# EAGLE schematic schematic (EAGLE 9.6.2)
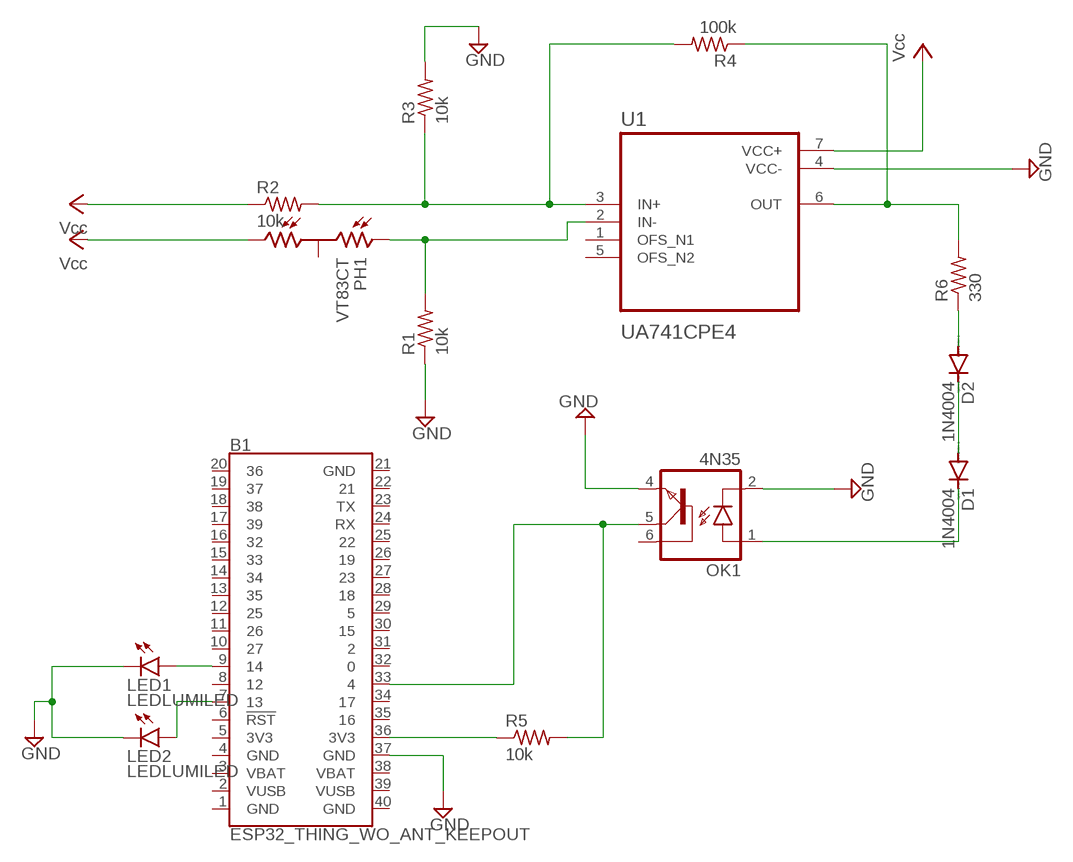
[diagram p0: schematic, sheet 1]

## Parts
B1  ESP32_THING_WO_ANT_KEEPOUT  [ESP32_THING_NO_ANT]
D1  1N4004  [DO41-10]
D2  1N4004  [DO41-10]
LED1  LEDLUMILED  [LUMILED]
LED2  LEDLUMILED  [LUMILED]
OK1  4N35  [DIL06]
PH1  VT83CT  [VT800CT]
R1  10k  R-US_0204/7  [0204/7]
R2  10k  R-US_0204/7  [0204/7]
R3  10k  R-US_0204/7  [0204/7]
R4  100k  R-US_0204/7  [0204/7]
R5  10k  R-US_0204/7  [0204/7]
R6  330  R-US_0204/7  [0204/7]
U1  UA741CPE4  [DIP794W45P254L959H508Q8]

## Nets
GND: B1.37(GND) LED1.4-(C) LED2.4-(C) OK1.2(C) OK1.4(EMI) R1.1 R3.2 U1.4(VCC-)
N$1: R2.2 R3.1 R4.2 U1.3(IN+)
N$2: PH1.1 R1.2 U1.2(IN-)
N$3: D2.A R6.1
N$4: R4.1 R6.2 U1.6(OUT)
N$5: B1.33 OK1.5(COL) R5.2
N$6: D1.A D2.C
N$7: D1.C OK1.1(A)
N$8: B1.36(3V3) R5.1
N$9: B1.9 LED1.2+(A)
N$10: B1.7 LED2.2+(A)
VCC: PH1.3 R2.1 U1.7(VCC+) ; supply symbol labelled Vcc
Unconnected: B1.1(GND) B1.2(VUSB) B1.3(VBAT) B1.4(GND) B1.5(3V3) B1.6(!RST!) B1.8 B1.10 B1.11 B1.12 B1.13 B1.14 B1.15 B1.16 B1.17 B1.18 B1.19 B1.20 B1.21(GND) B1.22 B1.23(TX) B1.24(RX) B1.25 B1.26 B1.27 B1.28 B1.29 B1.30 B1.31 B1.32 B1.34 B1.35 B1.38(VBAT) B1.39(VUSB) B1.40(GND) OK1.6(BAS) PH1.2 U1.1(OFS_N1) U1.5(OFS_N2)

## Library data of the parts
B1 = SparkFun-Boards:ESP32_THING: SparkFun ESP32 Thing Board Pins, silkscreen, and logos matching the layout of the SparkFun ESP32 Thing <https://www.sparkfun.com/products/13907> Dimensions: 2.32" x 1.00"
D1 D2 = diode:1N4004: DIODE general purpose rectifier, 1 A
LED1 LED2 = led-lumiled:LED: LED - LUMILED® LXK2-PW12-R00, LXK2-PW12-S00, LXK2-PW14-U00, LXK2-PW14-V00 LXK2-PM12-R00, LXK2-PM12-S00, LXK2-PM14-U00 LXK2-PE12-Q00, LXK2-PE12-R00, LXK2-PE12-S00, LXK2-PE14-T00, LXK2-PE14-U00 LXK2-PB12-K00, LXK2-PB12-L00, LXK2-PB12-M00, LXK2-PB14-N00, LXK2-PB14-P00, LXK2-PB14-Q00 LXK2-PR12-L00, LXK2-PR12-M00, LXK2-PR14-Q00, LXK2-PR14-R00 LXK2-PD12-Q00, LXK2-PD12-R00, LXK2-PD12-S00 LXK2-PH12-R00, LXK2-PH12-S00 LXK2-PL12-P00, LXK2-PL12-Q00, LXK2-PL12-R00 Source: www.luxeon.com; OC_FARNELL: unknown; OC_NEWARK: unknown
OK1 = optocoupler:4N35: MOTOROLA OPTO COUPLER; MF: FAIRCHILD SEMICONDUCTOR; MPN: 4N35; OC_FARNELL: 1328375; OC_NEWARK: 72K9946
PH1 = photo-elements:VT83CT: Photo Sensor Dual element VT800CT Series Source: http://optoelectronics.perkinelmer.com/content/Datasheets/DTS_vt800ctseriesdatasheet.pdf
R1-R6 = rcl:R-US_: RESISTOR, American symbol; SPICEPREFIX: R
U1 = UA741CPE4:UA741CPE4: Check availability <https://pricing.snapeda.com/parts/UA741CPE4/Texas%20Instruments/view-part?ref=eda>; AVAILABILITY: In Stock; CHECK_PRICES: https://www.snapeda.com/parts/UA741CPE4/Texas+Instruments/view-part/?ref=eda; DESCRIPTION: General-Purpose Operational Amplifier 8-PDIP 0 to 70; MF: Texas Instruments; MP: UA741CPE4; PACKAGE: PDIP-8 Texas; PRICE: None; SNAPEDA_LINK: https://www.snapeda.com/parts/UA741CPE4/Texas+Instruments/view-part/?ref=snap